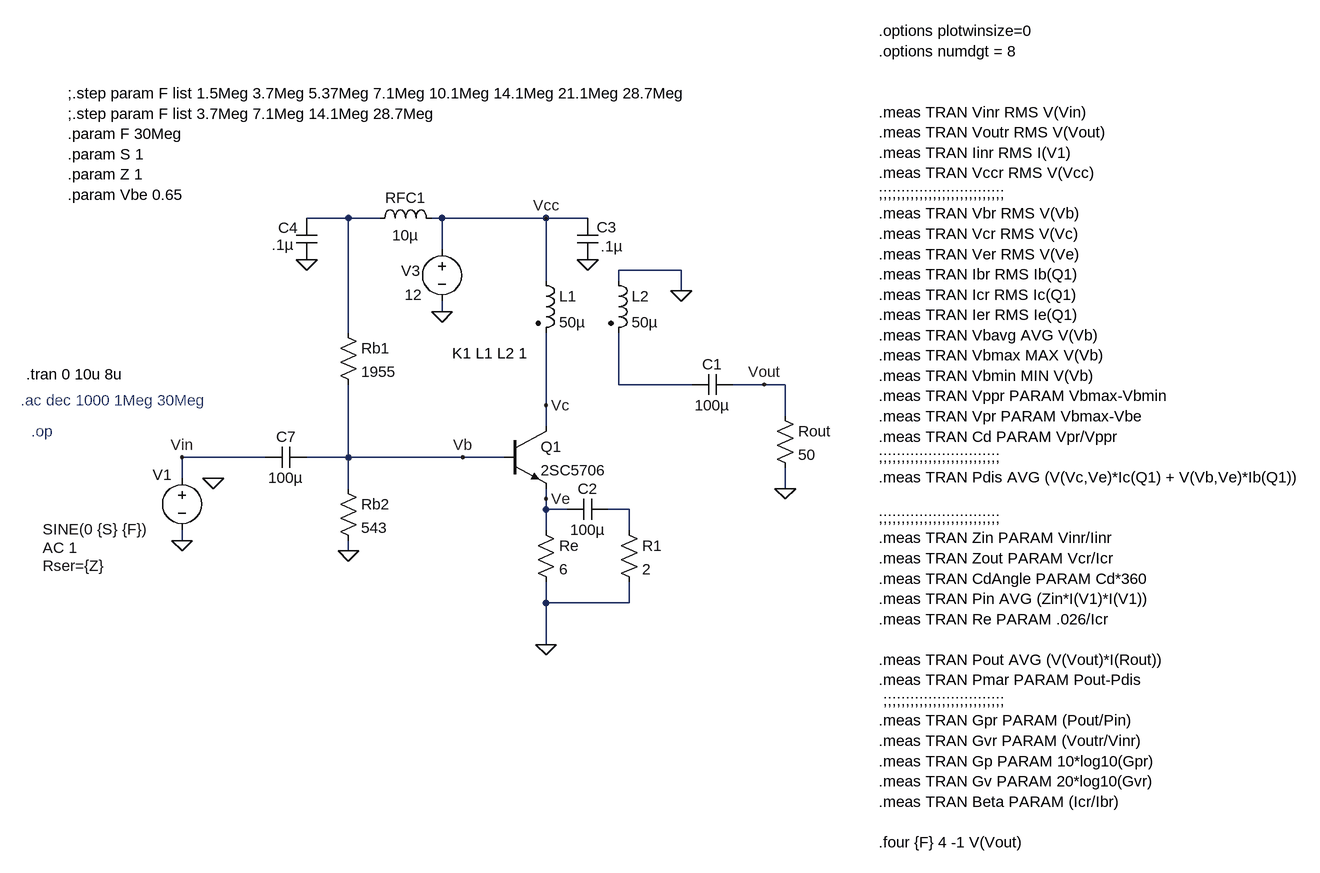
[diagram p0: schematic 2sc5706 testing.asc]
2sc5706 testing.asc, the LTspice schematic file:
Version 4
SHEET 1 2128 1496
WIRE 112 -176 48 -176
WIRE 160 -176 112 -176
WIRE 256 -176 240 -176
WIRE 416 -176 256 -176
WIRE 480 -176 416 -176
WIRE 256 -128 256 -176
WIRE 624 -96 528 -96
WIRE 416 -80 416 -176
WIRE 528 -80 528 -96
WIRE 624 -64 624 -96
WIRE 256 -32 256 -48
WIRE 112 0 112 -176
WIRE 528 80 528 0
WIRE 640 80 528 80
WIRE 752 80 704 80
WIRE 784 80 752 80
WIRE 416 112 416 0
WIRE 784 128 784 80
WIRE 416 144 416 112
WIRE -16 192 -144 192
WIRE 112 192 112 80
WIRE 112 192 48 192
WIRE 288 192 112 192
WIRE 352 192 288 192
WIRE -144 224 -144 192
WIRE 112 240 112 192
WIRE 784 240 784 208
WIRE 416 256 416 240
WIRE 416 272 416 256
WIRE 448 272 416 272
WIRE 544 272 512 272
WIRE 416 304 416 272
WIRE 544 304 544 272
WIRE -144 320 -144 304
WIRE 112 336 112 320
WIRE 416 416 416 384
WIRE 544 416 544 384
WIRE 544 416 416 416
WIRE 416 480 416 416
FLAG -144 320 0
FLAG 112 336 0
FLAG 416 480 0
FLAG 752 80 Vout
FLAG 784 240 0
FLAG 288 192 Vb
FLAG 416 256 Ve
FLAG -144 192 Vin
FLAG 416 112 Vc
FLAG 256 -32 0
FLAG 48 -112 0
FLAG 480 -112 0
FLAG -96 224 0
FLAG 416 -176 Vcc
FLAG 624 -64 0
SYMBOL voltage -144 208 R0
WINDOW 0 -45 11 Left 2
WINDOW 3 -214 95 Left 2
WINDOW 123 -214 123 Left 2
WINDOW 39 -214 151 Left 2
SYMATTR InstName V1
SYMATTR Value SINE(0 {S} {F})
SYMATTR Value2 AC 1
SYMATTR SpiceLine Rser={Z}
SYMBOL res 96 -16 R0
SYMATTR InstName Rb1
SYMATTR Value 1955
SYMBOL res 96 224 R0
SYMATTR InstName Rb2
SYMATTR Value 543
SYMBOL res 400 288 R0
SYMATTR InstName Re
SYMATTR Value 6
SYMBOL res 768 112 R0
SYMATTR InstName Rout
SYMATTR Value 50
SYMBOL cap 48 176 R90
WINDOW 0 0 32 VBottom 2
WINDOW 3 32 32 VTop 2
SYMATTR InstName C7
SYMATTR Value 100µ
SYMBOL npn 352 144 R0
SYMATTR InstName Q1
SYMATTR Value 2SC5706
SYMBOL voltage 256 -144 R0
WINDOW 123 0 0 Left 0
WINDOW 39 0 0 Left 0
WINDOW 0 -63 49 Left 2
WINDOW 3 -57 86 Left 2
SYMATTR InstName V3
SYMATTR Value 12
SYMBOL cap 704 64 R90
WINDOW 0 0 32 VBottom 2
WINDOW 3 32 32 VTop 2
SYMATTR InstName C1
SYMATTR Value 100µ
SYMBOL cap 512 256 R90
WINDOW 0 0 32 VBottom 2
WINDOW 3 32 32 VTop 2
SYMATTR InstName C2
SYMATTR Value 100µ
SYMBOL ind 144 -160 R270
WINDOW 0 32 56 VTop 2
WINDOW 3 5 56 VBottom 2
SYMATTR InstName RFC1
SYMATTR Value 10µ
SYMBOL cap 32 -176 R0
WINDOW 0 -28 15 Left 2
WINDOW 3 -38 41 Left 2
SYMATTR InstName C4
SYMATTR Value .1µ
SYMBOL cap 464 -176 R0
WINDOW 0 30 14 Left 2
WINDOW 3 36 43 Left 2
SYMATTR InstName C3
SYMATTR Value .1µ
SYMBOL res 528 288 R0
SYMATTR InstName R1
SYMATTR Value 2
SYMBOL ind2 400 -96 R0
SYMATTR InstName L1
SYMATTR Value 50µ
SYMATTR Type ind
SYMBOL ind2 512 -96 R0
SYMATTR InstName L2
SYMATTR Value 50µ
SYMATTR Type ind
TEXT -384 64 Left 2 !.tran 0 10u 8u
TEXT 928 -464 Left 2 !.options plotwinsize=0\n.options numdgt = 8\n \n \n.meas TRAN Vinr RMS V(Vin)\n.meas TRAN Voutr RMS V(Vout)\n.meas TRAN Iinr RMS I(V1)\n.meas TRAN Vccr RMS V(Vcc)\n;;;;;;;;;;;;;;;;;;;;;;;;;;;;\n.meas TRAN Vbr RMS V(Vb)\n.meas TRAN Vcr RMS V(Vc)\n.meas TRAN Ver RMS V(Ve)\n.meas TRAN Ibr RMS Ib(Q1)\n.meas TRAN Icr RMS Ic(Q1)\n.meas TRAN Ier RMS Ie(Q1)\n.meas TRAN Vbavg AVG V(Vb)\n.meas TRAN Vbmax MAX V(Vb)\n.meas TRAN Vbmin MIN V(Vb)\n.meas TRAN Vppr PARAM Vbmax-Vbmin\n.meas TRAN Vpr PARAM Vbmax-Vbe\n.meas TRAN Cd PARAM Vpr/Vppr\n;;;;;;;;;;;;;;;;;;;;;;;;;;;\n.meas TRAN Pdis AVG (V(Vc,Ve)*Ic(Q1) + V(Vb,Ve)*Ib(Q1))\n \n;;;;;;;;;;;;;;;;;;;;;;;;;;;\n.meas TRAN Zin PARAM Vinr/Iinr\n.meas TRAN Zout PARAM Vcr/Icr\n.meas TRAN CdAngle PARAM Cd*360\n.meas TRAN Pin AVG (Zin*I(V1)*I(V1))\n.meas TRAN Re PARAM .026/Icr\n \n.meas TRAN Pout AVG (V(Vout)*I(Rout))\n.meas TRAN Pmar PARAM Pout-Pdis\n ;;;;;;;;;;;;;;;;;;;;;;;;;;;\n.meas TRAN Gpr PARAM (Pout/Pin)\n.meas TRAN Gvr PARAM (Voutr/Vinr)\n.meas TRAN Gp PARAM 10*log10(Gpr)\n.meas TRAN Gv PARAM 20*log10(Gvr)\n.meas TRAN Beta PARAM (Icr/Ibr)\n \n.four {F} 4 -1 V(Vout)
TEXT -320 -368 Left 2 !;.step param F list 1.5Meg 3.7Meg 5.37Meg 7.1Meg 10.1Meg 14.1Meg 21.1Meg 28.7Meg\n;.step param F list 3.7Meg 7.1Meg 14.1Meg 28.7Meg\n.param F 30Meg\n.param S 1\n.param Z 1\n.param Vbe 0.65
TEXT -392 104 Left 2 ;.ac dec 1000 1Meg 30Meg
TEXT -376 152 Left 2 ;.op
TEXT 272 32 Left 2 !K1 L1 L2 1

The netlist it stands for:
* 2sc5706 testing.asc
V1 Vin 0 SINE(0 {S} {F}) AC 1 Rser={Z}
Rb1 N001 Vb 1955
Rb2 Vb 0 543
Re Ve 0 6
Rout Vout 0 50
C7 Vb Vin 100µ
Q1 Vc Vb Ve 0 2SC5706
V3 Vcc 0 12
C1 Vout N002 100µ
C2 N003 Ve 100µ
L§RFC1 N001 Vcc 10µ
C4 N001 0 .1µ
C3 Vcc 0 .1µ
R1 N003 0 2
L1 Vcc Vc 50µ
L2 0 N002 50µ
.model NPN NPN
.model PNP PNP
.lib standard.bjt
.tran 0 10u 8u
.options plotwinsize=0
.options numdgt = 8
.meas TRAN Vinr RMS V(Vin)
.meas TRAN Voutr RMS V(Vout)
.meas TRAN Iinr RMS I(V1)
.meas TRAN Vccr RMS V(Vcc)
;;;;;;;;;;;;;;;;;;;;;;;;;;;;
.meas TRAN Vbr RMS V(Vb)
.meas TRAN Vcr RMS V(Vc)
.meas TRAN Ver RMS V(Ve)
.meas TRAN Ibr RMS Ib(Q1)
.meas TRAN Icr RMS Ic(Q1)
.meas TRAN Ier RMS Ie(Q1)
.meas TRAN Vbavg AVG V(Vb)
.meas TRAN Vbmax MAX V(Vb)
.meas TRAN Vbmin MIN V(Vb)
.meas TRAN Vppr PARAM Vbmax-Vbmin
.meas TRAN Vpr PARAM Vbmax-Vbe
.meas TRAN Cd PARAM Vpr/Vppr
;;;;;;;;;;;;;;;;;;;;;;;;;;;
.meas TRAN Pdis AVG (V(Vc,Ve)*Ic(Q1) + V(Vb,Ve)*Ib(Q1))
;;;;;;;;;;;;;;;;;;;;;;;;;;;
.meas TRAN Zin PARAM Vinr/Iinr
.meas TRAN Zout PARAM Vcr/Icr
.meas TRAN CdAngle PARAM Cd*360
.meas TRAN Pin AVG (Zin*I(V1)*I(V1))
.meas TRAN Re PARAM .026/Icr
.meas TRAN Pout AVG (V(Vout)*I(Rout))
.meas TRAN Pmar PARAM Pout-Pdis
 ;;;;;;;;;;;;;;;;;;;;;;;;;;;
.meas TRAN Gpr PARAM (Pout/Pin)
.meas TRAN Gvr PARAM (Voutr/Vinr)
.meas TRAN Gp PARAM 10*log10(Gpr)
.meas TRAN Gv PARAM 20*log10(Gvr)
.meas TRAN Beta PARAM (Icr/Ibr)
.four {F} 4 -1 V(Vout)
;.step param F list 1.5Meg 3.7Meg 5.37Meg 7.1Meg 10.1Meg 14.1Meg 21.1Meg 28.7Meg
;.step param F list 3.7Meg 7.1Meg 14.1Meg 28.7Meg
.param F 30Meg
.param S 1
.param Z 1
.param Vbe 0.65
* .ac dec 1000 1Meg 30Meg
* .op
K1 L1 L2 1
.backanno
.end